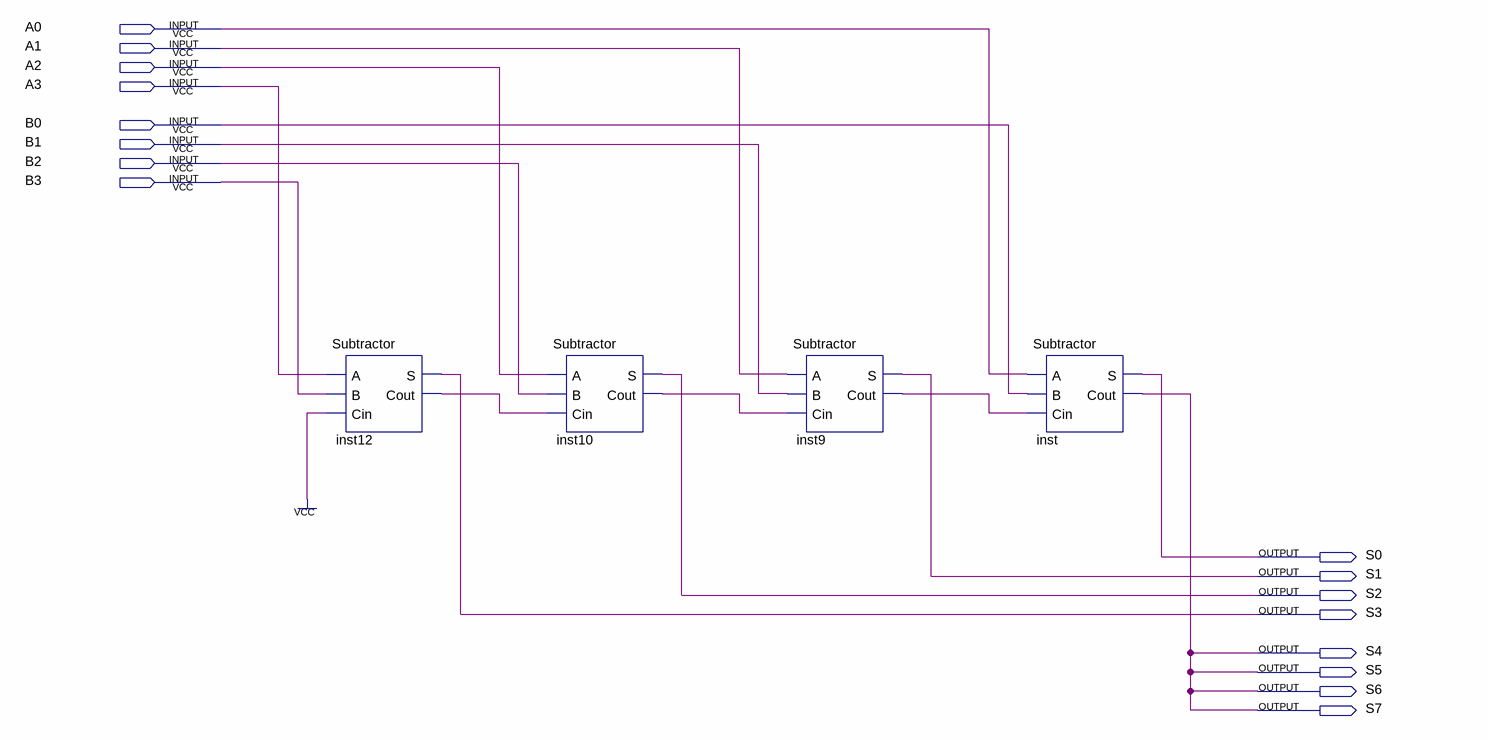
[diagram p0: schematic sheet]
// Quartus schematic Subtractor_4_bits.bdf as structural Verilog: 4 symbols, 16 pins
module Subtractor_4_bits (
  input  A0,
  input  A1,
  input  A2,
  input  A3,
  input  B0,
  input  B1,
  input  B2,
  input  B3,
  output S0,
  output S1,
  output S2,
  output S3,
  output S4,
  output S5,
  output S6,
  output S7
);

  wire inst9_cout, inst10_cout, inst12_cout;

  Subtractor inst12 (.A(A3), .B(B3), .Cin(1'b1), .S(S3), .Cout(inst12_cout));
  Subtractor inst10 (.A(A2), .B(B2), .Cin(inst12_cout), .S(S2), .Cout(inst10_cout));
  Subtractor inst9 (.A(A1), .B(B1), .Cin(inst10_cout), .S(S1), .Cout(inst9_cout));
  Subtractor inst (.A(A0), .B(B0), .Cin(inst9_cout), .S(S0), .Cout(S4));

  assign S5 = S4;
  assign S6 = S4;
  assign S7 = S4;
endmodule
